# EAGLE design MeeBooster_knobs (EAGLE 7.5.0)
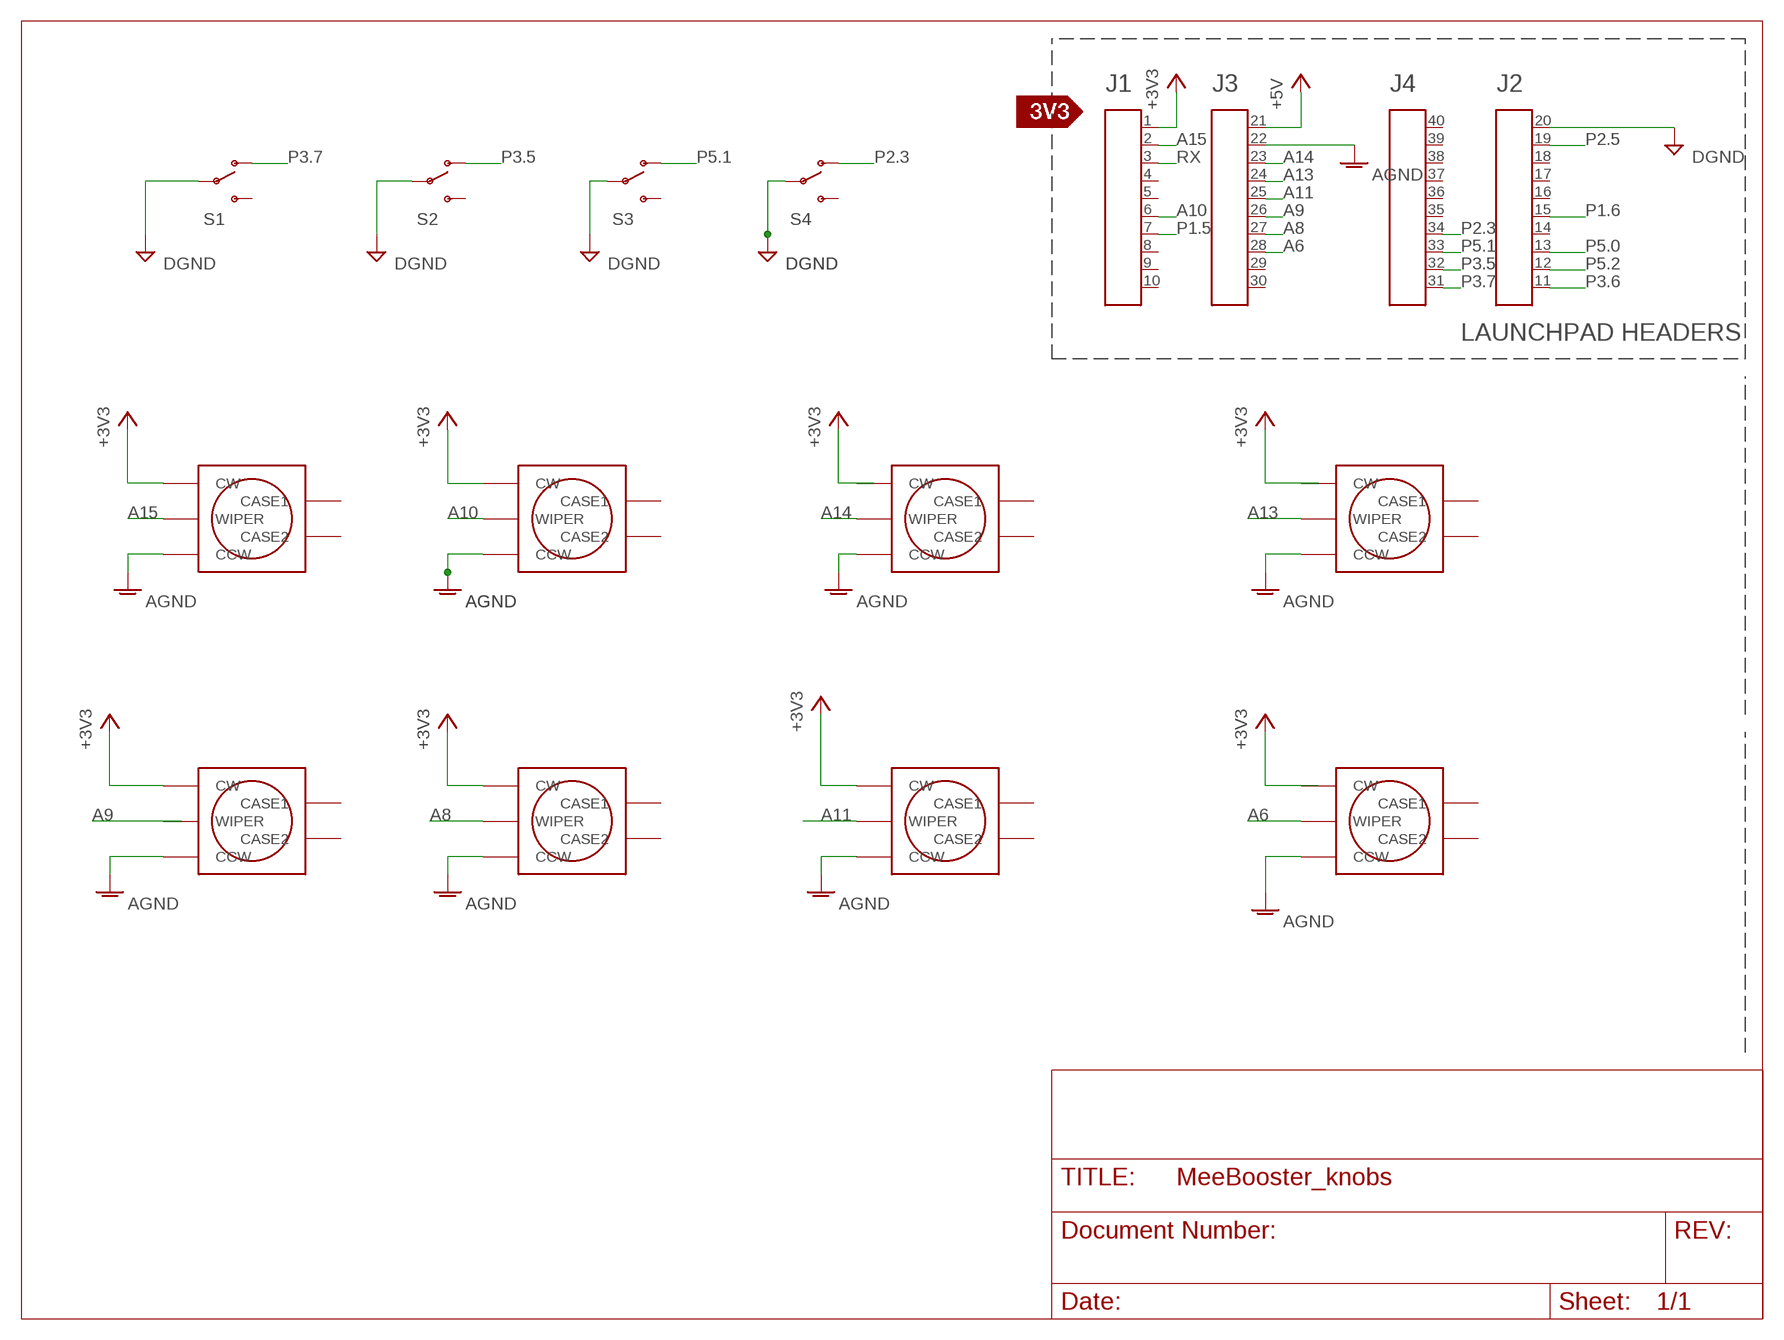
[diagram p0: schematic, sheet 1]

## Parts
A1  HEADER4X10-BOOSTERPACK  [4X10-BOOSTERPACK]
S1  SWITCH-SPSTPTH  [SWITCH-SPDT]
S2  SWITCH-SPSTPTH  [SWITCH-SPDT]
S3  SWITCH-SPSTPTH  [SWITCH-SPDT]
S4  SWITCH-SPSTPTH  [SWITCH-SPDT]
U$1  VACOLOCO_EVUFRK09_POT  [VACOLOCO_EVUF]
U$2  VACOLOCO_EVUFRK09_POT  [VACOLOCO_EVUF]
U$3  SILK_3V3_TAG  [SILK_3V3_TAG]
U$4  VACOLOCO_EVUFRK09_POT  [VACOLOCO_EVUF]
U$5  VACOLOCO_EVUFRK09_POT  [VACOLOCO_EVUF]
U$6  VACOLOCO_EVUFRK09_POT  [VACOLOCO_EVUF]
U$7  VACOLOCO_EVUFRK09_POT  [VACOLOCO_EVUF]
U$8  VACOLOCO_EVUFRK09_POT  [VACOLOCO_EVUF]
U$9  VACOLOCO_EVUFRK09_POT  [VACOLOCO_EVUF]

## Nets
5V: A1.1
+3V3: U$1.CW U$2.CW U$6.CW U$7.CW U$8.CW
+5V: A1.21
A6: A1.28 U$9.WIPER
A8: A1.27 U$7.WIPER
A9: A1.26
A10: A1.6 U$2.WIPER
A11: A1.25 U$8.WIPER
A13: A1.24 U$5.WIPER
A14: A1.23 U$4.WIPER
A15: A1.2 U$1.WIPER
AGND: A1.22 U$1.CCW U$2.CCW U$4.CCW U$5.CCW U$6.CCW U$7.CCW U$8.CCW U$9.CCW
DGND: A1.20 S1.2(P) S2.2(P) S3.2(P) S4.2(P)
P1.5: A1.7
P1.6: A1.15
P2.3: A1.34 S4.1(O)
P2.5: A1.19
P3.5: A1.32 S2.1(O)
P3.6: A1.11
P3.7: A1.31 S1.1(O)
P5.0: A1.13
P5.1: A1.33 S3.1(O)
P5.2: A1.12
RX: A1.3
Unconnected: A1.4 A1.5 A1.8 A1.9 A1.10 A1.14 A1.16 A1.17 A1.18 A1.29 A1.30 A1.35 A1.36 A1.37 A1.38 A1.39 A1.40 S1.3(S) S2.3(S) S3.3(S) S4.3(S) U$1.CASE1 U$1.CASE2 U$2.CASE1 U$2.CASE2 U$4.CASE1 U$4.CASE2 U$4.CW U$5.CASE1 U$5.CASE2 U$5.CW U$6.CASE1 U$6.CASE2 U$6.WIPER U$7.CASE1 U$7.CASE2 U$8.CASE1 U$8.CASE2 U$9.CASE1 U$9.CASE2 U$9.CW

## Notes on the sheet
- LAUNCHPAD HEADERS

## Library data of the parts
A1 = Public_BP_Library:HEADER4X10-BOOSTERPACK
S1-S4 = meeblip:SWITCH-SPST: SPDT Switch ON-ON slide switch. Mouser part #102-1221-EV
U$1 U$2 U$4-U$9 = meeblip-MOD:VACOLOCO_EVUF: Panasonic EVUF type potentionmeter Vertical Mount
U$3 = Public_BP_Library:SILK_3V3_TAG

## Board
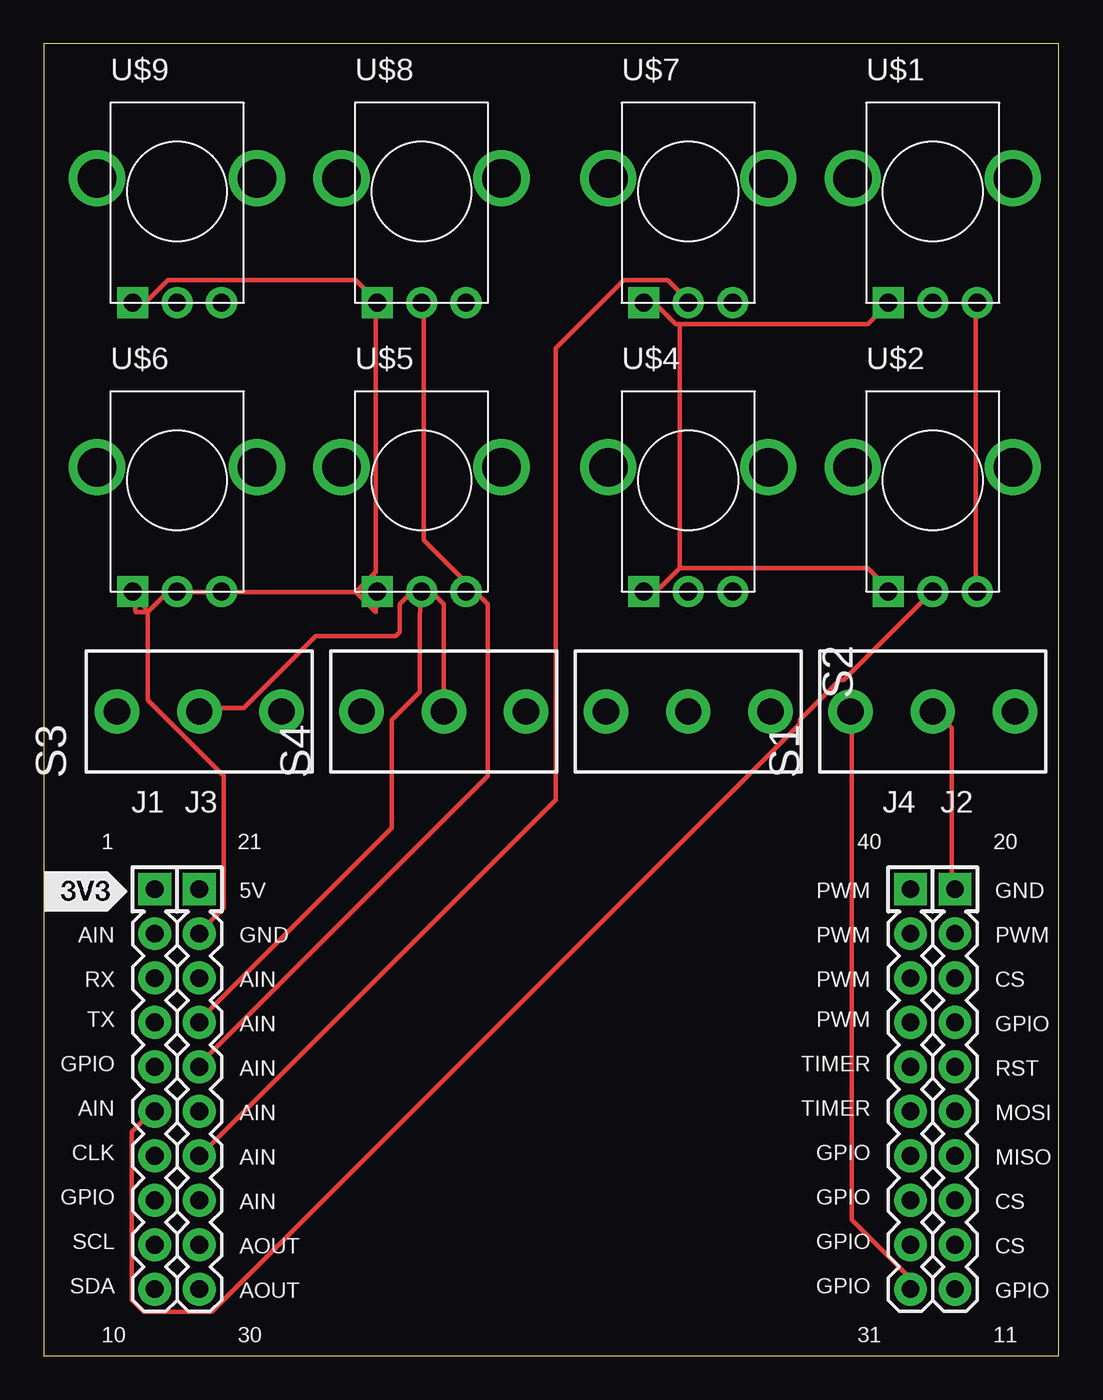
[diagram p1: board, top side]
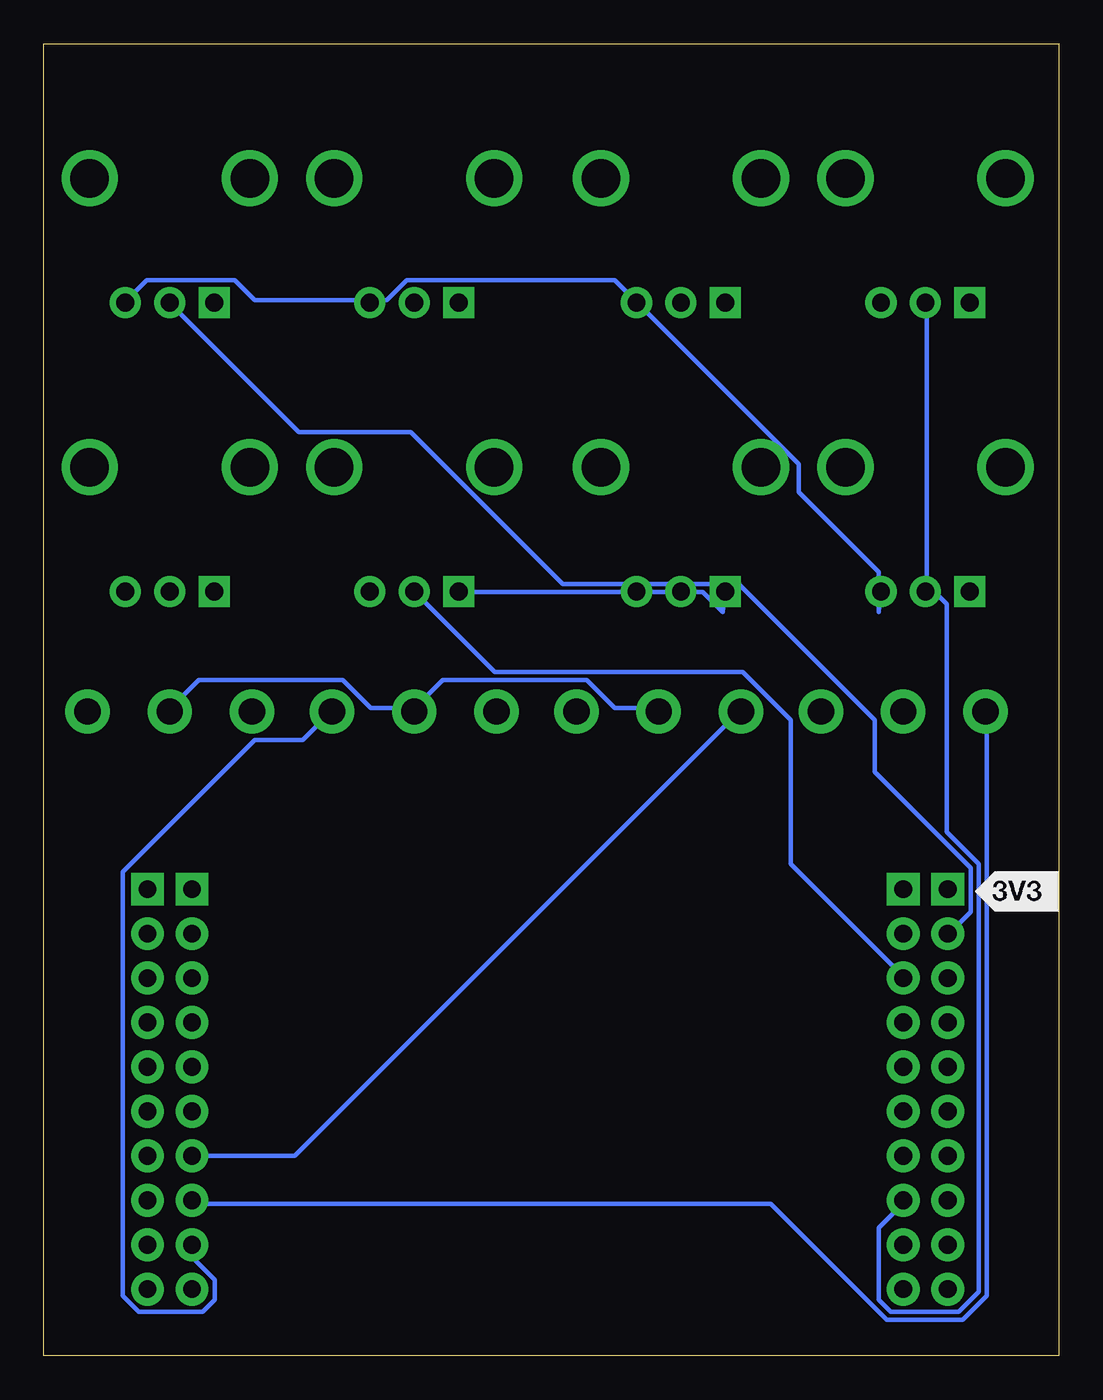
[diagram p2: board, bottom side, seen from below]

Size 58 x 75 mm. Coordinates in mm from the lower left corner, seen from the top.
Outline: 0,0 58,0 58,75 0,75 0,0
Copper layers (1*16): Top 0.035mm / dielectric 1.5mm / Bottom 0.035mm
Design rules "default": minimum track width 10mil, minimum drill 24mil, track to track 8mil, track to pad 8mil, pad to pad 8mil, via to via 8mil, smd to smd 8mil, copper to edge 40mil, drill to drill 8mil, minimum pad ring 10mil, minimum via ring 8mil, stop-mask expansion 4mil, vias tented up to drill 0mil, thermal gap 10mil

### Footprints (pad centres in the part's own frame; a part is rotated, then mirrored left to right if it is on the bottom)
4X10-BOOSTERPACK = drill 1.016 pad 1.88 square: 1 0,10.16; 20 45.72,10.16; 21 2.54,10.16; 40 43.18,10.16 | drill 1.016 pad 1.88: 2 0,7.62; 3 0,5.08; 4 0,2.54; 5 0,0; 6 0,-2.54; 7 0,-5.08; 8 0,-7.62; 9 0,-10.16; 10 0,-12.7; 11 45.72,-12.7; 12 45.72,-10.16; 13 45.72,-7.62; 14 45.72,-5.08; 15 45.72,-2.54; 16 45.72,0; 17 45.72,2.54; 18 45.72,5.08; 19 45.72,7.62; 22 2.54,7.62; 23 2.54,5.08; 24 2.54,2.54; 25 2.54,0; 26 2.54,-2.54; 27 2.54,-5.08; 28 2.54,-7.62; 29 2.54,-10.16; 30 2.54,-12.7; 31 43.18,-12.7; 32 43.18,-10.16; 33 43.18,-7.62; 34 43.18,-5.08; 35 43.18,-2.54; 36 43.18,0; 37 43.18,2.54; 38 43.18,5.08; 39 43.18,7.62
SWITCH-SPDT = drill 1.5 pad 2.54: 1 0,4.699; 2 0,0; 3 0,-4.699
VACOLOCO_EVUF = drill 2.2: CASE1 -4.572,0; CASE2 4.572,0 | drill 1.016 pad 1.778 square: CCW -2.54,-7.112 | drill 1.016 pad 1.778: CW 2.54,-7.112; WIPER 0,-7.112

### Placement (x,y rotation side)
A1  6.35,16.51 0 top
S1  50.8,36.83 90 top
S2  36.83,36.83 270 top
S3  8.89,36.83 90 top
S4  22.86,36.83 90 top
U$1  50.8,67.31 0 top
U$2  50.8,50.8 0 top
U$3  0,25.4 0 top
U$4  36.83,50.8 0 top
U$5  21.59,50.8 0 top
U$6  7.62,50.8 0 top
U$7  36.83,67.31 0 top
U$8  21.59,67.31 0 top
U$9  7.62,67.31 0 top

### Tracks (layer width: path | path; a pad name or v marks a point on that pad's centre or on a via)
+3V3
  Top 0.254: U$2.CW 53.26,43.89 53.26,60.12 U$1.CW
  Bottom 0.254: U$1.CW 53.26,60.35 52.12,61.49 47.09,61.49 45.95,60.35 39.55,60.35 U$7.CW 39.32,60.35 38.41,60.35 37.26,61.49 25.38,61.49 24.23,60.35 U$8.CW 24,60.12 14.86,50.98 14.86,49.38 10.29,44.81 10.29,42.52 U$6.CW
A6
  Bottom 0.254: U$9.WIPER 7.54,60.12 7.54,44.12 6.4,42.98 6.4,29.95 4.57,28.12 4.57,3.66 5.71,2.52 9.6,2.52 10.29,3.2 10.29,7.32 8.91,8.69 A1.28
A8
  Top 0.254: U$7.WIPER 36.8,60.35 35.66,61.49 33.15,61.49 29.26,57.61 29.26,31.77 8.91,11.43 A1.27
A10
  Top 0.254: U$2.WIPER 50.75,43.66 45.72,38.63 45.49,38.63 43.2,36.35 43.2,36.12 9.6,2.52 5.71,2.52 5.03,3.2 5.03,12.8 6.17,13.95 A1.6
A11
  Top 0.254: U$8.WIPER 21.72,60.12 21.72,46.63 25.38,42.98 25.38,33.15 8.91,16.69 A1.25
A13
  Top 0.254: U$5.WIPER 21.49,42.29 21.49,37.95 19.89,36.35 19.89,30.18 8.91,19.2 A1.24
A14
  Bottom 0.254: U$4.WIPER 32.23,39.09 18.06,39.09 15.32,36.35 15.32,28.12 8.91,21.72 A1.23
A15
  Bottom 0.254: U$1.WIPER 50.75,60.12 43.43,52.81 37.03,52.81 28.35,44.12 18.29,44.12 10.52,36.35 10.52,33.38 5.03,27.89 5.03,25.38 6.17,24.23 A1.2
AGND
  Top 0.254: 36.35,45.03 35.2,43.89 34.29,43.89 U$4.CCW | 36.35,45.03 47.09,45.03 48.23,43.89 U$2.CCW | 36.35,58.98 47.09,58.98 48.23,60.12 U$1.CCW | 36.35,58.98 36.12,58.98 34.98,60.12 34.29,60.12 U$7.CCW | 36.35,58.98 36.35,45.03 | U$9.CCW 5.26,60.35 5.94,60.35 7.09,61.49 17.83,61.49 18.97,60.35 U$8.CCW 18.97,60.12 18.97,44.81 17.83,43.66 | 5.94,42.52 5.26,42.52 U$6.CCW 5.94,42.52 | 5.94,42.52 7.09,43.66 17.83,43.66 | 17.83,43.66 18.97,42.52 U$5.CCW | 5.94,42.52 5.94,37.49 10.29,33.15 10.29,25.6 8.91,24.23 A1.22
  Bottom 0.254: U$4.CCW 34.29,43.66 20.34,43.66 19.2,42.52 U$5.CCW
DGND
  Top 0.254: S4.2 22.86,42.98 22.17,43.66 21.03,43.66 20.34,42.98 20.34,41.38 20.12,41.15 15.54,41.15 11.43,37.03 8.91,37.03 S3.2 | A1.20 51.89,26.75 51.89,35.89 50.98,36.8 S1.2
  Bottom 0.254: S1.2 50.75,37.03 49.15,38.63 40.92,38.63 39.32,37.03 37.03,37.03 S2.2 36.8,37.03 35.2,38.63 26.98,38.63 25.38,37.03 22.86,37.03 S4.2
P2.3
  Bottom 0.254: A1.34 43.66,11.43 18.29,36.8 S4.1
P3.5
  Bottom 0.254: A1.32 49.38,6.17 49.38,5.49 48.23,4.34 48.23,3.2 48.92,2.52 52.58,2.52 53.49,3.43 53.49,27.66 45.95,35.2 43.2,35.2 41.6,36.8 S2.1
P3.7
  Top 0.254: A1.31 49.38,3.89 49.38,4.57 46.18,7.77 46.18,36.8 S1.1
P5.1
  Bottom 0.254: A1.33 49.38,8.69 16.46,8.69 9.83,2.06 5.49,2.06 4.12,3.43 4.12,36.8 S3.1